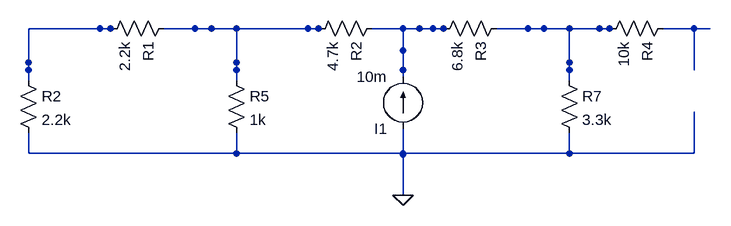
[diagram p0: schematic pannel2_solution.asc]
pannel2_solution.asc, the LTspice schematic file:
Version 4
SHEET 1 880 680
WIRE 448 400 448 372
WIRE 448 512 448 480
SYMBOL res 432 384 R0
SYMATTR InstName R5
SYMATTR Value 1k
WIRE 960 400 960 372
WIRE 960 512 960 480
SYMBOL res 944 384 R0
SYMATTR InstName R7
SYMATTR Value 3.3k
WIRE 656 320 729 320
WIRE 558 320 574 320
SYMBOL res 672 304 R90
SYMATTR InstName R2
SYMATTR Value 4.7k
WIRE 1104 320 1177 320
WIRE 1006 320 1022 320
SYMBOL res 1120 304 R90
SYMATTR InstName R4
SYMATTR Value 10k
WIRE 848 320 921 320
WIRE 750 320 766 320
SYMBOL res 864 304 R90
SYMATTR InstName R3
SYMATTR Value 6.8k
WIRE 336 320 409 320
WIRE 238 320 254 320
SYMBOL res 352 304 R90
SYMATTR InstName R1
SYMATTR Value 2.2k
WIRE 128 400 128 372
WIRE 128 512 128 480
SYMBOL res 112 384 R0
SYMATTR InstName R2
SYMATTR Value 2.2k
WIRE 704 474 704 514
WIRE 704 354 704 394
SYMBOL current 704 474 R180
SYMATTR InstName I1
SYMATTR Value 10m
FLAG 704 576 0
WIRE 448 320 512 320
WIRE 448 320 448 384
WIRE 384 320 448 320
WIRE 704 320 704 384
WIRE 704 320 768 320
WIRE 960 320 1024 320
WIRE 960 320 960 384
WIRE 896 320 960 320
WIRE 1152 320 1152 384
WIRE 1088 512 1152 512
WIRE 1152 448 1152 512
WIRE 384 512 448 512
WIRE 448 512 512 512
WIRE 640 512 704 512
WIRE 704 512 768 512
WIRE 704 512 704 576
WIRE 896 512 960 512
WIRE 960 512 1024 512
WIRE 128 512 192 512
WIRE 128 320 192 320
WIRE 128 320 128 384
WIRE 512 320 576 320
WIRE 256 512 320 512
WIRE 192 512 256 512
WIRE 320 512 384 512
WIRE 512 512 576 512
WIRE 576 512 640 512
WIRE 768 512 832 512
WIRE 832 512 896 512
WIRE 1024 512 1088 512
WIRE 192 320 256 320

The netlist it stands for:
* pannel2_solution.asc
R5 N001 0 1k
R7 N002 0 3.3k
R2 N003 N001 4.7k
R4 N004 N002 10k
R3 N002 N003 6.8k
R1 N001 N005 2.2k
R2 N005 0 2.2k
I1 0 N003 10m
.backanno
.end